# Altium schematic sheet AKS.SchDoc
size A3; SheetNumber: 1; SheetTotal: 1
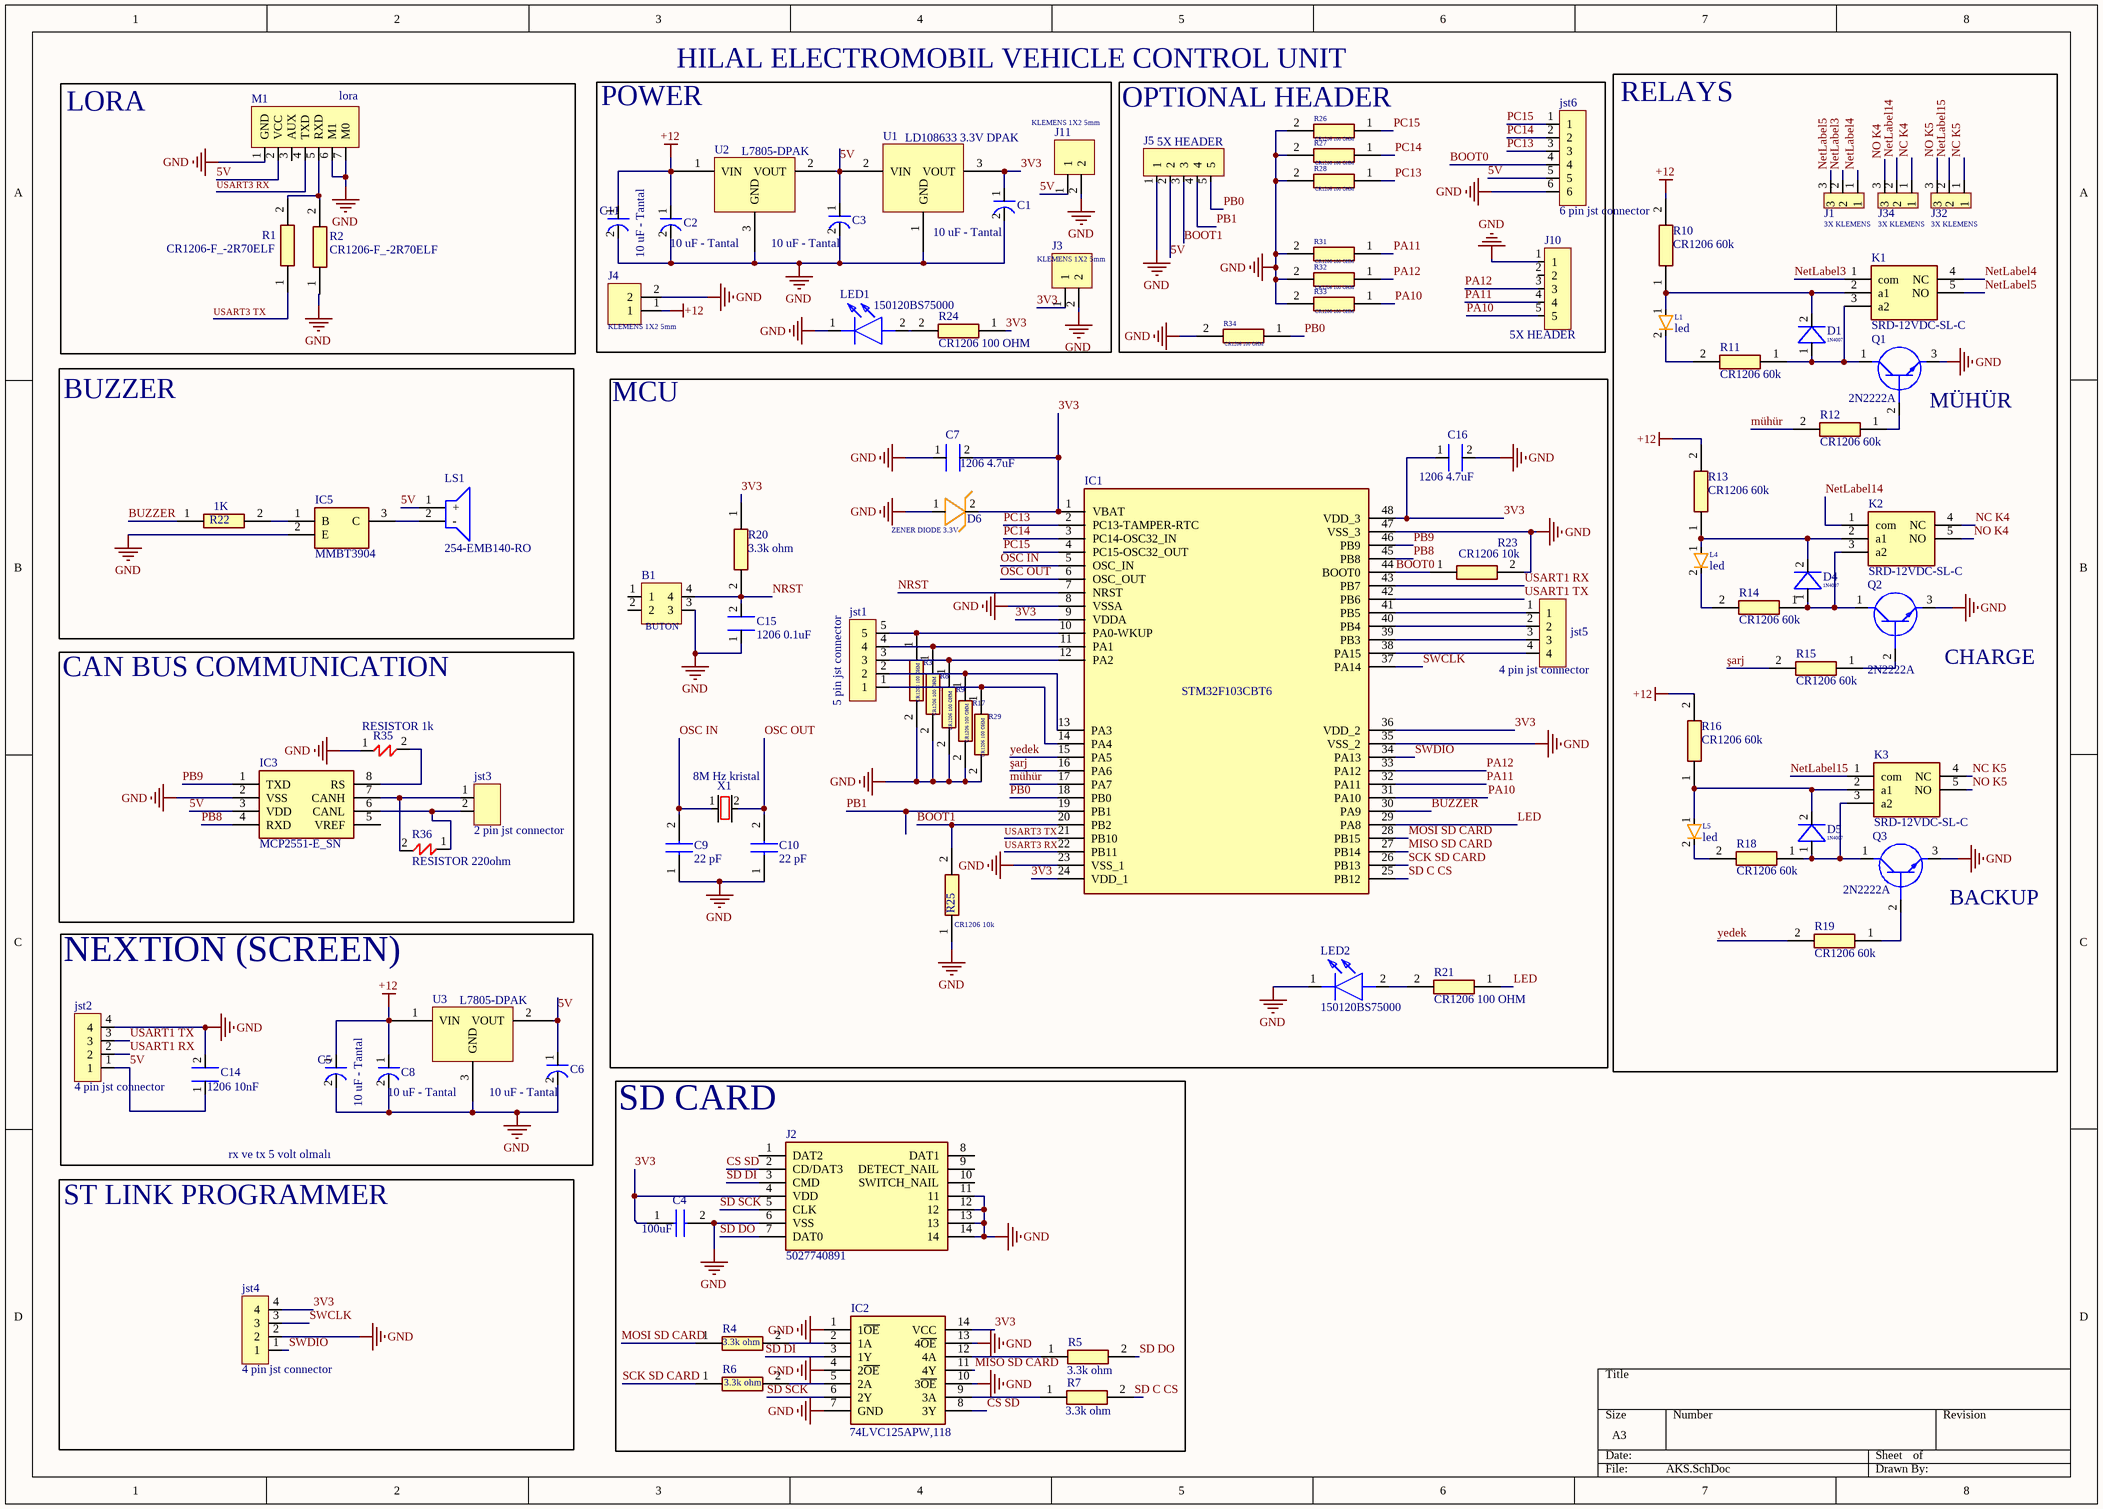
[diagram p0: AKS.SchDoc]

## Parts
B1  BUTON  [BUTON]
C1  10 uF - Tantal  [C1206-TANT]
C2  10 uF - Tantal  [C1206-TANT]
C3  10 uF - Tantal  [C1206-TANT]
C4  100uF  [CAPC2012X94N]
C5  10 uF - Tantal  [C1206-TANT]
C6  10 uF - Tantal  [C1206-TANT]
C7  1206 4.7uF  [C1206]
C8  10 uF - Tantal  [C1206-TANT]
C9  22 pF  [CAPC2012X94N]
C10  22 pF  [CAPC2012X94N]
C11  10 uF - Tantal  [C1206-TANT]
C14  1206 10nF  [C1206]
C15  1206 0.1uF  [C1206]
C16  1206 4.7uF  [C1206]
D1  1N4007  [SF-26 DIODE]
D4  1N4007  [SF-26 DIODE]
D5  1N4007  [SF-26 DIODE]
D6  ZENER DIODE 3.3V  [3.3 VOLT ZENER]
IC1  STM32F103CBT6  [QFP50P900X900X160-48N]
IC2  74LVC125APW,118  [SOP65P640X110-14N]
IC3  MCP2551-E_SN  [SOIC127P600X175-8N]
IC5  MMBT3904  [SOT95P240X120-3N]
J1  3X KLEMENS  [3x klemens 5mm]
J2  5027740891  [5027740891]
J3  KLEMENS 1X2 5mm  [KLEMENS 1x2 - 5mm]
J4  KLEMENS 1X2 5mm  [KLEMENS 1x2 - 5mm]
J5  5X HEADER  [5X HEADER]
J10  5X HEADER  [5X HEADER]
J11  KLEMENS 1X2 5mm  [KLEMENS 1x2 - 5mm]
J32  3X KLEMENS  [3x klemens 5mm]
J34  3X KLEMENS  [3x klemens 5mm]
jst1  5 pin jst connector  [5 pin jst]
jst2  4 pin jst connector  [4pin-jst]
jst3  2 pin jst connector  [2 pin jst connector]
jst4  4 pin jst connector  [4pin-jst]
jst5  4 pin jst connector  [4pin-jst]
jst6  6 pin jst connector  [6 pin jst connecttor]
K1  SRD-12VDC-SL-C  [RELAY]
K2  SRD-12VDC-SL-C  [RELAY]
K3  SRD-12VDC-SL-C  [RELAY]
L1  led  [led]
L4  led  [led]
L5  led  [led]
LED1  150120BS75000  [LEDC3214X78N]
LED2  150120BS75000  [LEDC3214X78N]
LS1  254-EMB140-RO  [254EMB140RO]
M1  lora  [LORA]
Q1  2N2222A  [2N2222A]
Q2  2N2222A  [2N2222A]
Q3  2N2222A  [2N2222A]
R1  CR1206-F_-2R70ELF  [RESC3216X75N]
R2  CR1206-F_-2R70ELF  [RESC3216X75N]
R3  CR1206 100 OHM  [RESC3216X75N]
R4  3.3k ohm  [RESC2012X65N]
R5  3.3k ohm  [RESC2012X65N]
R6  3.3k ohm  [RESC2012X65N]
R7  3.3k ohm  [RESC2012X65N]
R8  CR1206 100 OHM  [RESC3216X75N]
R9  CR1206 100 OHM  [RESC3216X75N]
R10  CR1206 60k  [RESC3216X75N]
R11  CR1206 60k  [RESC3216X75N]
R12  CR1206 60k  [RESC3216X75N]
R13  CR1206 60k  [RESC3216X75N]
R14  CR1206 60k  [RESC3216X75N]
R15  CR1206 60k  [RESC3216X75N]
R16  CR1206 60k  [RESC3216X75N]
R17  CR1206 100 OHM  [RESC3216X75N]
R18  CR1206 60k  [RESC3216X75N]
R19  CR1206 60k  [RESC3216X75N]
R20  3.3k ohm  [RESC2012X65N]
R21  CR1206 100 OHM  [RESC3216X75N]
R22  1K  [RESC2012X65N]
R23  CR1206 10k  [RESC3216X75N]
R24  CR1206 100 OHM  [RESC3216X75N]
R25  CR1206 10k  [RESC3216X75N]
R26  CR1206 100 OHM  [RESC3216X75N]
R27  CR1206 100 OHM  [RESC3216X75N]
R28  CR1206 100 OHM  [RESC3216X75N]
R29  CR1206 100 OHM  [RESC3216X75N]
R31  CR1206 100 OHM  [RESC3216X75N]
R32  CR1206 100 OHM  [RESC3216X75N]
R33  CR1206 100 OHM  [RESC3216X75N]
R34  CR1206 100 OHM  [RESC3216X75N]
R35  RESISTOR 1k  [GENERAL RESISTOR]
R36  RESISTOR 220ohm  [GENERAL RESISTOR]
U1  LD108633 3.3V DPAK  [DPAK228P972X240-3N]
U2  L7805-DPAK  [DPAK228P972X240-3N]
U3  L7805-DPAK  [DPAK228P972X240-3N]
X1  8M Hz kristal  [8M Hz kristal]

## Blocks framed on the sheet
LORA: M1 R1 R2
OPTIONAL HEADER: J5 J10 jst6 R26-R28 R31-R34
RELAYS: D1 D4 D5 J1 J32 J34 K1-K3 L1 L4 L5 Q1-Q3 R10-R16 R18 R19
BUZZER: IC5 LS1 R22
CAN BUS COMMUNICATION: IC3 jst3 R35 R36
NEXTION (SCREEN): C5 C6 C8 C14 jst2 U3
SD CARD: C4 IC2 J2 R4-R7
ST LINK PROGRAMMER: jst4

## Nets
+12: C2.1 C5.1 C8.1 C11.1 J4.1 R10.2 R13.2 R16.2 U2.1(VIN) U3.1(VIN)
GND: B1.3 C1.2 C2.2 C3.2 C4.2 C5.2 C6.2 C7.1 C8.2 C9.1 C10.1 C11.2 C14.2 C15.1 C16.2 D6.1 IC1.8(VSSA) IC1.23(VSS_1) IC1.35(VSS_2) IC1.47(VSS_3) IC2.1(1~{OE}) IC2.4(2~{OE}) IC2.7(GND) IC2.10(3~{OE}) IC2.13(4~{OE}) IC3.2(VSS) IC5.2(E) J2.6(VSS) J2.11 J2.12 J2.13 J2.14 J3.2 J4.2 J5.1 J10.1 J11.2 jst2.4 jst4.2 jst6.6 LED1.1(K) LED2.1(K) M1.1(GND) M1.6(M1) M1.7(M0) Q1.3(E) Q2.3(E) Q3.3(E) R2.1 R3.2 R8.2 R9.2 R17.2 R23.2 R25.1 R26.2 R27.2 R28.2 R29.2 R31.2 R32.2 R33.2 R34.2 R35.1 U1.1(GND) U2.3(GND) U3.3(GND)
3V3: C1.1 C4.1 C7.2 C16.1 D6.2 IC1.1(VBAT) IC1.9(VDDA) IC1.24(VDD_1) IC1.36(VDD_2) IC1.48(VDD_3) IC2.14(VCC) J2.4(VDD) J3.1 jst4.4 R20.1 R24.1 U1.3(VOUT)
5V: C3.1 C6.1 C14.1 IC3.3(VDD) J5.2 J11.1 jst2.1 jst6.5 LS1.1(+) M1.2(VCC) U1.2(VIN) U2.2(VOUT) U3.2(VOUT)
BOOT0: IC1.44(BOOT0) jst6.4 R23.1
BOOT1: IC1.20(PB2) J5.3 R25.2
BUZZER: IC1.30(PA9) R22.1
CS SD: IC2.8(3Y) J2.2(CD/DAT3)
LED: IC1.29(PA8) R21.1
MISO SD CARD: IC1.27(PB14) IC2.11(4Y)
MOSI SD CARD: IC1.28(PB15) R4.1
mühür: IC1.17(PA7) R12.2
NC K4: J34.1 K2.4(NC)
NC K5: J32.1 K3.4(NC)
NetLabel3: J1.2 K1.1(com)
NetLabel4: J1.1 K1.4(NC)
NetLabel5: J1.3 K1.5(NO)
NetLabel14: J34.2 K2.1(com)
NetLabel15: J32.2 K3.1(com)
NO K4: J34.3 K2.5(NO)
NO K5: J32.3 K3.5(NO)
NRST: B1.4 C15.2 IC1.7(NRST) R20.2
OSC IN: C9.2 IC1.5(OSC_IN) X1.1
OSC OUT: C10.2 IC1.6(OSC_OUT) X1.2
PA10: IC1.31(PA10) J10.5 R33.1
PA11: IC1.32(PA11) J10.4 R31.1
PA12: IC1.33(PA12) J10.3 R32.1
PB0: IC1.18(PB0) J5.5 R34.1
PB1: IC1.19(PB1) J5.4
PB8: IC1.45(PB8) IC3.4(RXD)
PB9: IC1.46(PB9) IC3.1(TXD)
PC13: IC1.2(PC13-TAMPER-RTC) jst6.3 R28.1
PC14: IC1.3(PC14-OSC32_IN) jst6.2 R27.1
PC15: IC1.4(PC15-OSC32_OUT) jst6.1 R26.1
SCK SD CARD: IC1.26(PB13) R6.1
SD C CS: IC1.25(PB12) R7.2
SD DI: IC2.3(1Y) J2.3(CMD)
SD DO: J2.7(DAT0) R5.2
SD SCK: IC2.6(2Y) J2.5(CLK)
SWCLK: IC1.37(PA14) jst4.3
SWDIO: IC1.34(PA13) jst4.1
USART1 RX: IC1.43(PB7) jst2.2
USART1 TX: IC1.42(PB6) jst2.3
USART3 RX: IC1.22(PB11) M1.4(TXD)
USART3 TX: IC1.21(PB10) R1.1
yedek: IC1.15(PA5) R19.2
şarj: IC1.16(PA6) R15.2
NetD1_1: D1.1 K1.3(a2) Q1.1(C) R11.1
NetD1_2: D1.2 K1.2(a1) L1.1 R10.1
NetD4_1: D4.1 K2.3(a2) Q2.1(C) R14.1
NetD4_2: D4.2 K2.2(a1) L4.1 R13.1
NetD5_1: D5.1 K3.3(a2) Q3.1(C) R18.1
NetD5_2: D5.2 K3.2(a1) L5.1 R16.1
NetIC1_10: IC1.10(PA0-WKUP) jst1.5 R3.1
NetIC1_11: IC1.11(PA1) jst1.4 R8.1
NetIC1_12: IC1.12(PA2) jst1.3 R9.1
NetIC1_13: IC1.13(PA3) jst1.2 R17.1
NetIC1_14: IC1.14(PA4) jst1.1 R29.1
NetIC1_38: IC1.38(PA15) jst5.4
NetIC1_39: IC1.39(PB3) jst5.3
NetIC1_40: IC1.40(PB4) jst5.2
NetIC1_41: IC1.41(PB5) jst5.1
NetIC2_2: IC2.2(1A) R4.2
NetIC2_5: IC2.5(2A) R6.2
NetIC2_9: IC2.9(3A) R7.1
NetIC2_12: IC2.12(4A) R5.1
NetIC3_6: IC3.6(CANL) jst3.2 R36.1
NetIC3_7: IC3.7(CANH) jst3.1 R36.2
NetIC3_8: IC3.8(RS) R35.2
NetIC5_1: IC5.1(B) R22.2
NetIC5_3: IC5.3(C) LS1.2(-)
NetL1_2: L1.2 R11.2
NetL4_2: L4.2 R14.2
NetL5_2: L5.2 R18.2
NetLED1_2: LED1.2(A) R24.2
NetLED2_2: LED2.2(A) R21.2
NetM1_5: M1.5(RXD) R1.2 R2.2
NetQ1_2: Q1.2(B) R12.1
NetQ2_2: Q2.2(B) R15.1
NetQ3_2: Q3.2(B) R19.1

Not connected (* = marked no-connect by the designer): B1 1 2; IC3 5(VREF); J2 1(DAT2) 8(DAT1) 9(DETECT_NAIL) 10(SWITCH_NAIL); J10 2; M1 3(AUX)

## Notes on the sheet
- POWER
- HILAL ELECTROMOBIL VEHICLE CONTROL UNIT
- MCU
- (near Q1) MÜHÜR
- (near Q2) CHARGE
- (near Q3) BACKUP
- rx ve tx 5 volt olmalı

## Library data of the parts
C4 C9 C10 = 08055A150JAT2A: Capacitor; Manufacturer_Name: AVX; Datasheet Link: https://componentsearchengine.com/Datasheets/1/06031A100FAT2A.pdf; Height: 0.94mm; Manufacturer_Part_Number: 08055A150JAT2A; Mouser Part Number: 581-08055A150J; Mouser Price/Stock: https://www.mouser.co.uk/ProductDetail/AVX/08055A150JAT2A?qs=pZVDklL%2Fs8hiEua37sqbaA%3D%3D; Arrow Part Number: 08055A150JAT2A; Arrow Price/Stock: https://www.arrow.com/en/products/08055a150jat2a/avx?region=nac
C7 C14-C16 = 10 uF C1206
D1 D4 D5 = SF-26 DIODE: DIODE
D6 = ZENER DIODE 3.3V: ZENER DIODE
IC1 = STM32F103CBT6: Integrated Circuit; Manufacturer_Name: STMicroelectronics; Datasheet Link: http://www.st.com/st-web-ui/static/active/en/resource/technical/document/datasheet/CD00161566.pdf; Height: 1.6mm; Manufacturer_Part_Number: STM32F103CBT6; Mouser Part Number: 511-STM32F103CBT6; Mouser Price/Stock: https://www.mouser.co.uk/ProductDetail/STMicroelectronics/STM32F103CBT6?qs=WxFF5lh7QM3goh6GV5Ogig%3D%3D; Arrow Part Number: STM32F103CBT6; Arrow Price/Stock: https://www.arrow.com/en/products/stm32f103cbt6/stmicroelectronics?region=europe
IC2 = 74LVC125APW,118: Integrated Circuit; Manufacturer_Name: Nexperia; Datasheet Link: https://assets.nexperia.com/documents/data-sheet/74LVC125A.pdf; Height: 1.1mm; Manufacturer_Part_Number: 74LVC125APW,118; Mouser Part Number: 771-74LVC125APW-T; Mouser Price/Stock: https://www.mouser.co.uk/ProductDetail/Nexperia/74LVC125APW118?qs=me8TqzrmIYV8VAZOS5KVLw%3D%3D; Arrow Part Number: 74LVC125APW,118; Arrow Price/Stock: https://www.arrow.com/en/products/74lvc125apw118/nexperia?region=nac
IC3 = MCP2551-E_SN: Integrated Circuit; Manufacturer_Name: Microchip; Manufacturer_Part_Number: MCP2551-E/SN; Datasheet Link: https://datasheet.datasheetarchive.com/originals/distributors/SFDatasheet-4/sf-00090061.pdf; Height: 1.75mm; Mouser Part Number: 579-MCP2551-E/SN; Mouser Price/Stock: https://www.mouser.co.uk/ProductDetail/Microchip-Technology-Atmel/MCP2551-E-SN?qs=Vn0zuzr35GHkGDCgnw0F9A%3D%3D; Arrow Part Number: MCP2551-E/SN; Arrow Price/Stock: https://www.arrow.com/en/products/mcp2551-esn/microchip-technology
IC5 = MMBT3904: Integrated Circuit; Manufacturer_Name: Diotec; Datasheet Link: https://media.digikey.com/pdf/Data%20Sheets/ON%20Semiconductor%20PDFs/2N3904,MMBT3904,PZT3904.pdf; Height: 1.2mm; Manufacturer_Part_Number: MMBT3904; Mouser Part Number: 637-MMBT3904; Mouser Price/Stock: https://www.mouser.co.uk/ProductDetail/Diotec-Semiconductor/MMBT3904?qs=OlC7AqGiEDkK1MwiyUU6mg%3D%3D; Arrow Part Number: MMBT3904; Arrow Price/Stock: https://www.arrow.com/en/products/mmbt3904/diotec-semiconductor-ag?region=europe
J2 = 5027740891: Connector; Manufacturer_Name: Molex; Datasheet Link: https://www.molex.com/webdocs/datasheets/pdf/en-us/5027740891_MEMORY_CARD_SOCKET.pdf; Height: 1mm; Manufacturer_Part_Number: 5027740891; Arrow Part Number: 5027740891; Arrow Price/Stock: https://www.arrow.com/en/products/5027740891/molex?region=nac
J3 J4 J11 = KLEMENS 1X2 3.5mm: KLEMENS
jst6 = 6 pin jst connector: connector
K1-K3 = SRD-12VDC-SL-C: Relay or Contactor; Manufacturer_Name: Songle Relay; Manufacturer_Part_Number: SRD-12VDC-SL-C
LED1 LED2 = 150120BS75000: LED; Manufacturer_Name: Wurth Elektronik; Datasheet Link: https://katalog.we-online.de/led/datasheet/150120BS75000.pdf; Height: 0.78mm; Manufacturer_Part_Number: 150120BS75000; Mouser Part Number: 710-150120BS75000; Mouser Price/Stock: https://www.mouser.co.uk/ProductDetail/Wurth-Elektronik/150120BS75000?qs=LlUlMxKIyB1WGHUNBglvng%3D%3D
LS1 = 254-EMB140-RO: Loudspeaker or Buzzer; Manufacturer_Name: Kobitone; Datasheet Link: https://componentsearchengine.com/Datasheets/1/254-EMB140-RO.pdf; Height: 8.7mm; Manufacturer_Part_Number: 254-EMB140-RO; Mouser Part Number: 254-EMB140-RO; Mouser Price/Stock: https://www.mouser.com/Search/Refine.aspx?Keyword=254-EMB140-RO
Q1-Q3 = 2N2222A: Transistor BJT NPN; Manufacturer_Name: Foshan Blue Rocket Elec; Datasheet Link: https://datasheet.lcsc.com/szlcsc/1901291437_Foshan-Blue-Rocket-Elec-2N2222A_C358533.pdf; Height: 4.7mm; Manufacturer_Part_Number: 2N2222A
R1-R3 R8-R19 R21 R23-R29 R31-R34 = CR1206-F_-2R70ELF: Resistor; Manufacturer_Name: Bourns; Manufacturer_Part_Number: CR1206-F/-2R70ELF; Datasheet Link: https://mail.qq.com/cgi-bin/loginpage?autologin=n&errtype=1&clientuin=895793657&param=&sp=&tfcont=22%20serialization%3A%3Aarchive%2010%200%200%204%200%200%200%208%20authtype%201%204%209%20clientuin%209%20895793657%206%20domain%206%20qq.com%202%20vm%203%20; Height: 0.75mm; Mouser Part Number: 652-CR1206-F/2R70ELF; Mouser Price/Stock: https://www.mouser.co.uk/ProductDetail/Bourns/CR1206-F-2R70ELF?qs=W%2FMpXkg%252BdQ43a7iNS79Iog%3D%3D
R4-R7 R20 R22 = CPF0805B100RE1: Resistor; Manufacturer_Name: TE Connectivity; Datasheet Link: https://datasheet.datasheetarchive.com/originals/distributors/DKDS-21/401696.pdf; Height: 0.65mm; Manufacturer_Part_Number: CPF0805B100RE1; Mouser Part Number: 279-CPF0805B100RE1; Mouser Price/Stock: https://www.mouser.co.uk/ProductDetail/TE-Connectivity-Holsworthy/CPF0805B100RE1?qs=9ylKvqdyudkCWLPT1QvLZQ%3D%3D; Arrow Part Number: CPF0805B100RE1; Arrow Price/Stock: https://www.arrow.com/en/products/cpf0805b100re1/te-connectivity?region=nac
R35 R36 = RESISTOR: GENERAL TYPE THT RES
U1 = LD108633 3.3V DPAK: LD108633 3.3V REGULATOR
U2 U3 = L7805-DPAK: L7805 5V REGULATOR. SMD PAKET